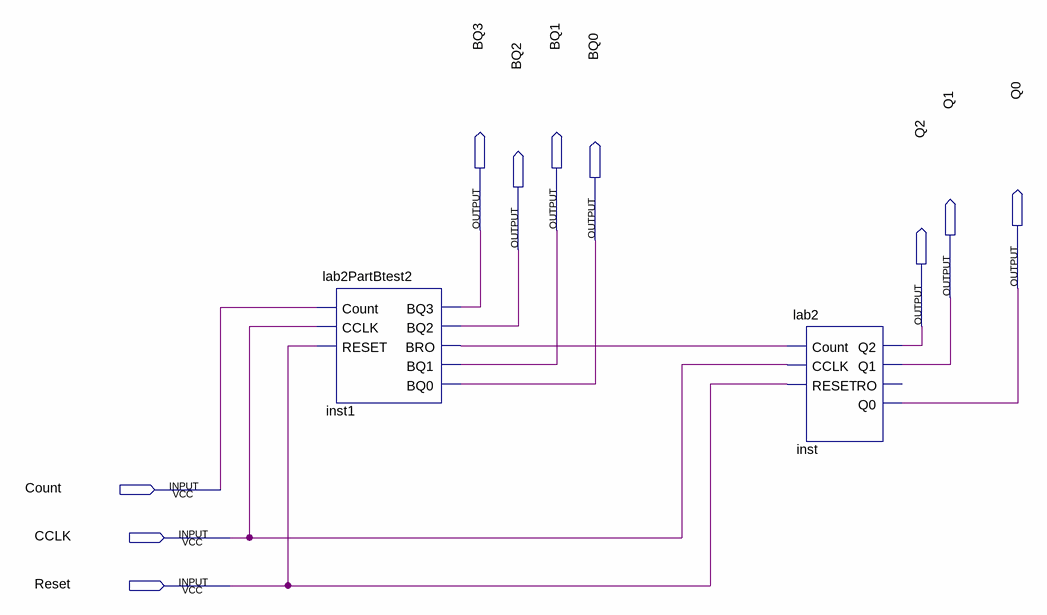
[diagram p0: schematic sheet]
// Quartus schematic mod60new.bdf as structural Verilog: 2 symbols, 10 pins
module mod60new (
  input  Count,
  input  CCLK,
  input  Reset,
  output BQ3,
  output BQ1,
  output BQ0,
  output BQ2,
  output Q0,
  output Q1,
  output Q2
);

  wire inst1_bro;

  lab2PartBtest2 inst1 (
    .CCLK(CCLK), .Count(Count), .RESET(Reset), .BQ0(BQ0), .BQ1(BQ1), .BQ2(BQ2), .BQ3(BQ3), .BRO(inst1_bro));
  lab2 inst (.Count(inst1_bro), .CCLK(CCLK), .RESET(Reset), .Q2(Q2), .Q1(Q1), .Q0(Q0));  // open: RO
endmodule
